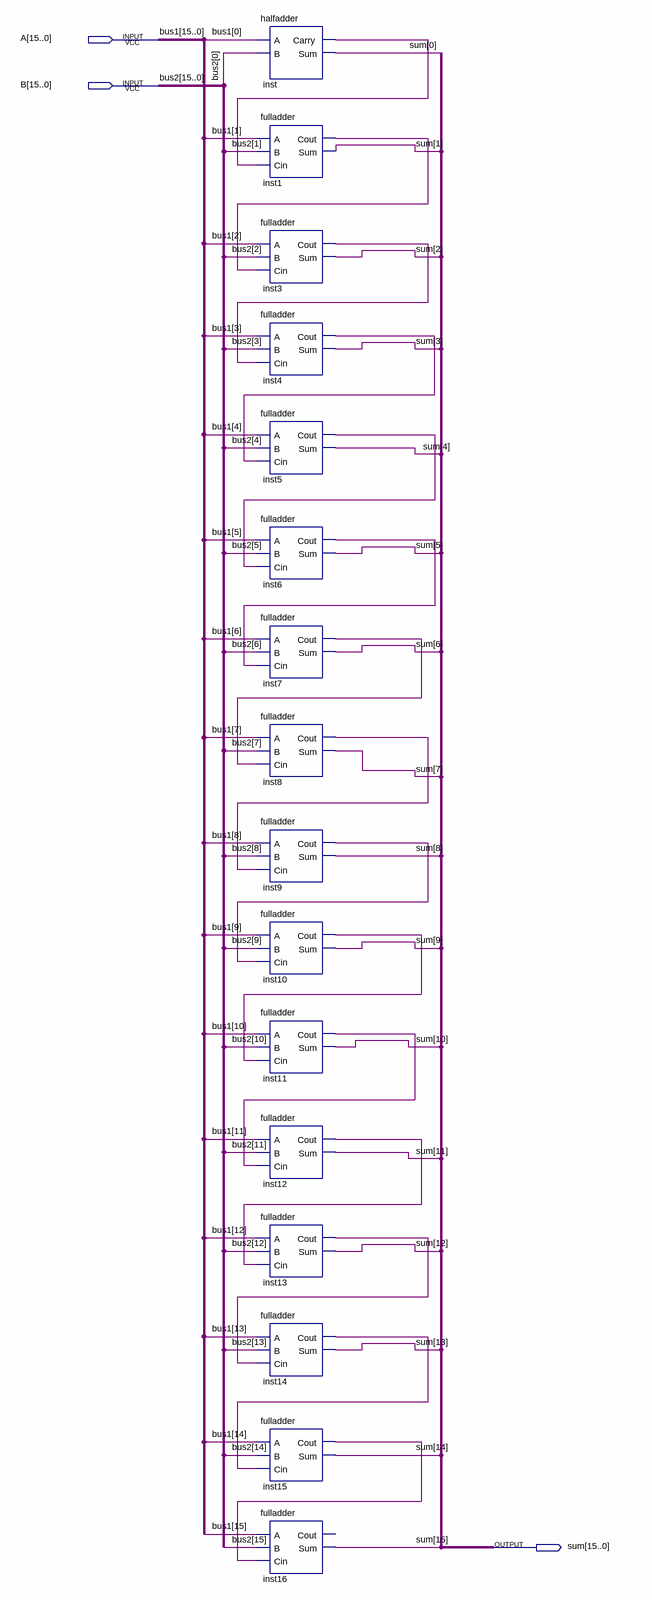
[diagram p0: schematic sheet]
// Quartus schematic adder16bit.bdf as structural Verilog: 16 symbols, 3 pins
module adder16bit (
  input  [15:0] A,
  input  [15:0] B,
  output [15:0] sum
);

  wire inst1_cout, inst3_cout, inst4_cout, inst5_cout, inst6_cout, inst7_cout, inst8_cout, inst9_cout,
       inst10_cout, inst11_cout, inst12_cout, inst13_cout, inst14_cout, inst15_cout, inst_carry;

  halfadder inst (.A(A[0]), .B(B[0]), .Carry(inst_carry), .Sum(sum[0]));
  fulladder inst1 (.A(A[1]), .B(B[1]), .Cin(inst_carry), .Cout(inst1_cout), .Sum(sum[1]));
  fulladder inst3 (.A(A[2]), .B(B[2]), .Cin(inst1_cout), .Cout(inst3_cout), .Sum(sum[2]));
  fulladder inst4 (.A(A[3]), .B(B[3]), .Cin(inst3_cout), .Cout(inst4_cout), .Sum(sum[3]));
  fulladder inst5 (.A(A[4]), .B(B[4]), .Cin(inst4_cout), .Cout(inst5_cout), .Sum(sum[4]));
  fulladder inst6 (.A(A[5]), .B(B[5]), .Cin(inst5_cout), .Cout(inst6_cout), .Sum(sum[5]));
  fulladder inst7 (.A(A[6]), .B(B[6]), .Cin(inst6_cout), .Cout(inst7_cout), .Sum(sum[6]));
  fulladder inst8 (.A(A[7]), .B(B[7]), .Cin(inst7_cout), .Cout(inst8_cout), .Sum(sum[7]));
  fulladder inst9 (.A(A[8]), .B(B[8]), .Cin(inst8_cout), .Cout(inst9_cout), .Sum(sum[8]));
  fulladder inst10 (.A(A[9]), .B(B[9]), .Cin(inst9_cout), .Cout(inst10_cout), .Sum(sum[9]));
  fulladder inst11 (.A(A[10]), .B(B[10]), .Cin(inst10_cout), .Cout(inst11_cout), .Sum(sum[10]));
  fulladder inst12 (.A(A[11]), .B(B[11]), .Cin(inst11_cout), .Cout(inst12_cout), .Sum(sum[11]));
  fulladder inst13 (.A(A[12]), .B(B[12]), .Cin(inst12_cout), .Cout(inst13_cout), .Sum(sum[12]));
  fulladder inst14 (.A(A[13]), .B(B[13]), .Cin(inst13_cout), .Cout(inst14_cout), .Sum(sum[13]));
  fulladder inst15 (.A(A[14]), .B(B[14]), .Cin(inst14_cout), .Cout(inst15_cout), .Sum(sum[14]));
  fulladder inst16 (.A(A[15]), .B(B[15]), .Cin(inst15_cout), .Sum(sum[15]));  // open: Cout

  // Other names for the same wires on the sheet: bus1[15:0] = A; bus2[15:0] = B
endmodule
